# Altium schematic sheet lctech_485.SchDoc
size 297 x 210 mm
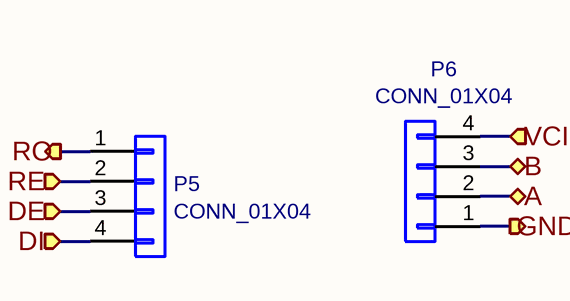
[diagram p0: lctech_485.SchDoc]

## Parts
P5  CONN_01X04  [Socket_Strip_Straight_1x04]
P6  CONN_01X04  [Socket_Strip_Straight_1x04]

## Ports
A (bidir), B (bidir), DE (in), DI (in), GND (out), RE (in), RO (out), VCIN (in)

## Nets
A: P6.2(P2) ; port A
B: P6.3(P3) ; port B
DE: P5.3(P3) ; port DE
DI: P5.4(P4) ; port DI
GND: P6.1(P1) ; port GND
RE: P5.2(P2) ; port RE
RO: P5.1(P1) ; port RO
VCIN: P6.4(P4) ; port VCIN

## Notes on the sheet
- 1
- 2
- 3
- 4
- 5
- 6
- A
- B
- C
- Size resistor values R1, R3, and R7 appropriately for your LED choices.
- Implements half-duplex with TX latched RE/DE
- Raspberry Pi / Arduino UART to RS485
- D
- Title: Pi485
- File: lctech_485.sch
- Sheet: /
- Bryan Varner
- KiCad E.D.A.  kicad (5.1.4)-1
- Size: A4
- Date: 2017-02-20
- Rev: 1.1.1
- Id: 2/2

## Library data of the parts
P5 P6 = CONN_01X04: Value: CONN_01X04; Footprint: Socket_Strips:Socket_Strip_Straight_1x04